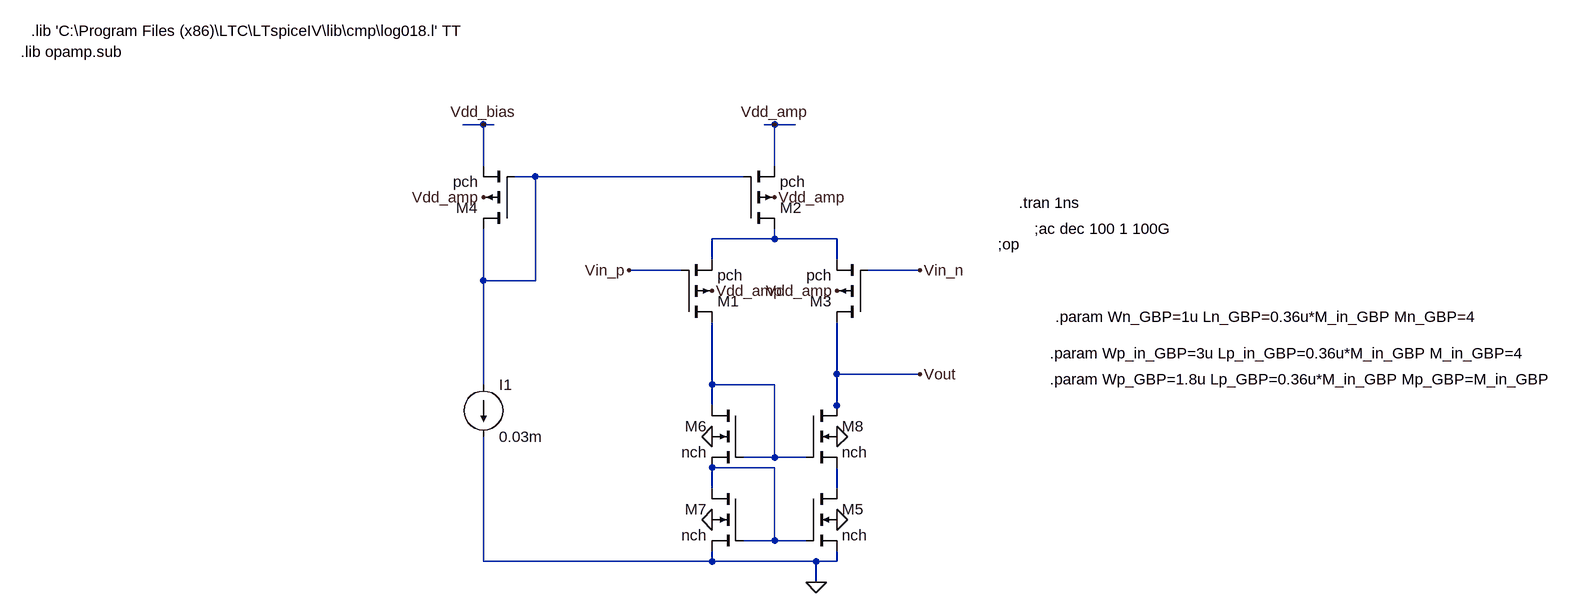
[diagram p0: schematic Diffp-GB.asc]
Diffp-GB.asc, the LTspice schematic file:
Version 4
SHEET 1 1532 680
WIRE -320 -112 -352 -112
WIRE -304 -112 -320 -112
WIRE 128 -112 112 -112
WIRE 160 -112 128 -112
WIRE -320 -48 -320 -112
WIRE 128 -48 128 -112
WIRE -240 -32 -272 -32
WIRE -112 -32 -240 -32
WIRE 80 -32 -112 -32
WIRE 128 64 128 48
WIRE 128 64 32 64
WIRE 208 64 128 64
WIRE 224 64 208 64
WIRE 32 96 32 64
WIRE 224 96 224 64
WIRE -48 112 -96 112
WIRE -16 112 -48 112
WIRE 304 112 272 112
WIRE 352 112 304 112
WIRE -320 128 -320 48
WIRE -240 128 -240 -32
WIRE -240 128 -320 128
WIRE 224 272 224 192
WIRE 304 272 224 272
WIRE 352 272 304 272
WIRE -320 288 -320 128
WIRE 32 288 32 192
WIRE 128 288 32 288
WIRE 32 320 32 288
WIRE 224 320 224 272
WIRE 224 336 224 320
WIRE 128 400 128 288
WIRE 128 400 80 400
WIRE 176 400 128 400
WIRE 128 416 32 416
WIRE 32 448 32 416
WIRE 224 448 224 416
WIRE 128 528 128 416
WIRE 128 528 80 528
WIRE 176 528 128 528
WIRE -320 560 -320 368
WIRE 32 560 32 544
WIRE 32 560 -320 560
WIRE 192 560 32 560
WIRE 224 560 224 544
WIRE 224 560 192 560
WIRE 192 592 192 560
FLAG 192 592 0
FLAG -320 -112 Vdd_bias
FLAG 128 -112 Vdd_amp
FLAG 128 0 Vdd_amp
FLAG 32 144 Vdd_amp
FLAG 224 144 Vdd_amp
FLAG -320 0 Vdd_amp
FLAG 32 496 0
FLAG 224 496 0
FLAG 352 272 Vout
FLAG -96 112 Vin_p
FLAG 352 112 Vin_n
FLAG 32 368 0
FLAG 224 368 0
DATAFLAG -112 -32 ""
DATAFLAG 208 64 ""
DATAFLAG 304 272 ""
DATAFLAG -48 112 ""
DATAFLAG 304 112 ""
DATAFLAG -64 240 "Id(x5:M1)"
SYMBOL pmos4 80 48 M180
SYMATTR InstName M2
SYMATTR Value pch
SYMATTR Value2 l={Lp_GBP} w={Wp_GBP} m={Mp_GBP}
SYMBOL current -320 288 R0
WINDOW 123 0 0 Left 2
WINDOW 39 0 0 Left 2
SYMATTR InstName I1
SYMATTR Value 0.03m
SYMBOL pmos4 -16 192 M180
SYMATTR InstName M1
SYMATTR Value pch
SYMATTR Value2 l={Lp_in_GBP} w={Wp_in_GBP} m={M_in_GBP}
SYMBOL nmos4 80 448 M0
SYMATTR InstName M7
SYMATTR Value nch
SYMATTR Value2 l={Ln_GBP} w={Wn_GBP} m={Mn_GBP}
SYMBOL pmos4 -272 48 R180
SYMATTR InstName M4
SYMATTR Value pch
SYMATTR Value2 l={Lp_GBP} w={Wp_GBP} m={Mp_GBP}
SYMBOL pmos4 272 192 R180
SYMATTR InstName M3
SYMATTR Value pch
SYMATTR Value2 l={Lp_in_GBP} w={Wp_in_GBP} m={M_in_GBP}
SYMBOL nmos4 176 448 R0
SYMATTR InstName M5
SYMATTR Value nch
SYMATTR Value2 l={Ln_GBP} w={Wn_GBP} m={Mn_GBP}
SYMBOL nmos4 80 320 M0
SYMATTR InstName M6
SYMATTR Value nch
SYMATTR Value2 l={Ln_GBP} w={Wn_GBP} m={Mn_GBP}
SYMBOL nmos4 176 320 R0
SYMATTR InstName M8
SYMATTR Value nch
SYMATTR Value2 l={Ln_GBP} w={Wn_GBP} m={Mn_GBP}
TEXT 560 184 Left 2 !.param Wn_GBP=1u Ln_GBP=0.36u*M_in_GBP Mn_GBP=4
TEXT 552 280 Left 2 !.param Wp_GBP=1.8u Lp_GBP=0.36u*M_in_GBP Mp_GBP=M_in_GBP
TEXT 552 240 Left 2 !.param Wp_in_GBP=3u Lp_in_GBP=0.36u*M_in_GBP M_in_GBP=4
TEXT 528 48 Left 2 !;ac dec 100 1 100G
TEXT 472 72 Left 2 !;op
TEXT 504 8 Left 2 !.tran 1ns
TEXT -1016 -256 Left 2 !.lib 'C:\\Program Files (x86)\\LTC\\LTspiceIV\\lib\\cmp\\log018.l' TT
TEXT -1032 -224 Left 2 !.lib opamp.sub

The netlist it stands for:
* Diffp-GB.asc
M2 N002 N001 Vdd_amp Vdd_amp pch l={Lp_GBP} w={Wp_GBP} m={Mp_GBP}
I1 N001 0 0.03m
M1 N003 Vin_p N002 Vdd_amp pch l={Lp_in_GBP} w={Wp_in_GBP} m={M_in_GBP}
M7 N004 N004 0 0 nch l={Ln_GBP} w={Wn_GBP} m={Mn_GBP}
M4 N001 N001 Vdd_bias Vdd_amp pch l={Lp_GBP} w={Wp_GBP} m={Mp_GBP}
M3 Vout Vin_n N002 Vdd_amp pch l={Lp_in_GBP} w={Wp_in_GBP} m={M_in_GBP}
M5 N005 N004 0 0 nch l={Ln_GBP} w={Wn_GBP} m={Mn_GBP}
M6 N003 N003 N004 0 nch l={Ln_GBP} w={Wn_GBP} m={Mn_GBP}
M8 Vout N003 N005 0 nch l={Ln_GBP} w={Wn_GBP} m={Mn_GBP}
.model NMOS NMOS
.model PMOS PMOS
.lib standard.mos
.param Wn_GBP=1u Ln_GBP=0.36u*M_in_GBP Mn_GBP=4
.param Wp_GBP=1.8u Lp_GBP=0.36u*M_in_GBP Mp_GBP=M_in_GBP
.param Wp_in_GBP=3u Lp_in_GBP=0.36u*M_in_GBP M_in_GBP=4
;ac dec 100 1 100G
;op
.tran 1ns
.lib 'C:\Program Files (x86)\LTC\LTspiceIV\lib\cmp\log018.l' TT
.lib opamp.sub
.backanno
.end